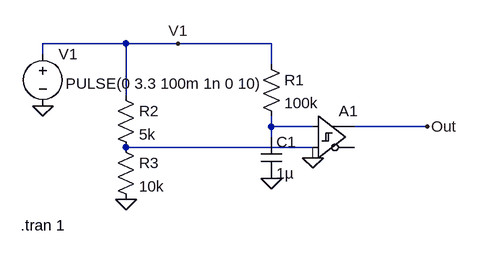
[diagram p0: schematic PoR.asc]
PoR.asc, the LTspice schematic file:
Version 4
SHEET 1 880 680
WIRE -112 32 -240 32
WIRE -32 32 -112 32
WIRE 112 32 -32 32
WIRE -240 48 -240 32
WIRE 112 64 112 32
WIRE -112 112 -112 32
WIRE 112 160 112 144
WIRE 176 160 112 160
WIRE 352 160 240 160
WIRE 112 176 112 160
WIRE 176 192 -112 192
FLAG 112 240 0
FLAG -240 128 0
FLAG 352 160 Out
FLAG -32 32 V1
FLAG -112 272 0
FLAG 176 208 0
SYMBOL cap 96 176 R0
SYMATTR InstName C1
SYMATTR Value 1µ
SYMBOL res 96 48 R0
SYMATTR InstName R1
SYMATTR Value 100k
SYMBOL voltage -240 32 R0
WINDOW 3 35 62 Left 2
WINDOW 123 0 0 Left 0
WINDOW 39 0 0 Left 0
SYMATTR InstName V1
SYMATTR Value PULSE(0 3.3 100m 1n 0 10)
SYMBOL Digital\\diffschmitt 176 112 R0
SYMATTR InstName A1
SYMBOL res -128 96 R0
SYMATTR InstName R2
SYMATTR Value 5k
SYMBOL res -128 176 R0
SYMATTR InstName R3
SYMATTR Value 10k
TEXT -274 312 Left 2 !.tran 1

The netlist it stands for:
* PoR.asc
C1 N001 0 1µ
R1 V1 N001 100k
V1 V1 0 PULSE(0 3.3 100m 1n 0 10)
A1 N001 N002 0 0 0 0 Out 0 SCHMITT
R2 V1 N002 5k
R3 N002 0 10k
.tran 1
.backanno
.end